# EAGLE design scoutmakes_robot_kit (EAGLE 9.6.1)
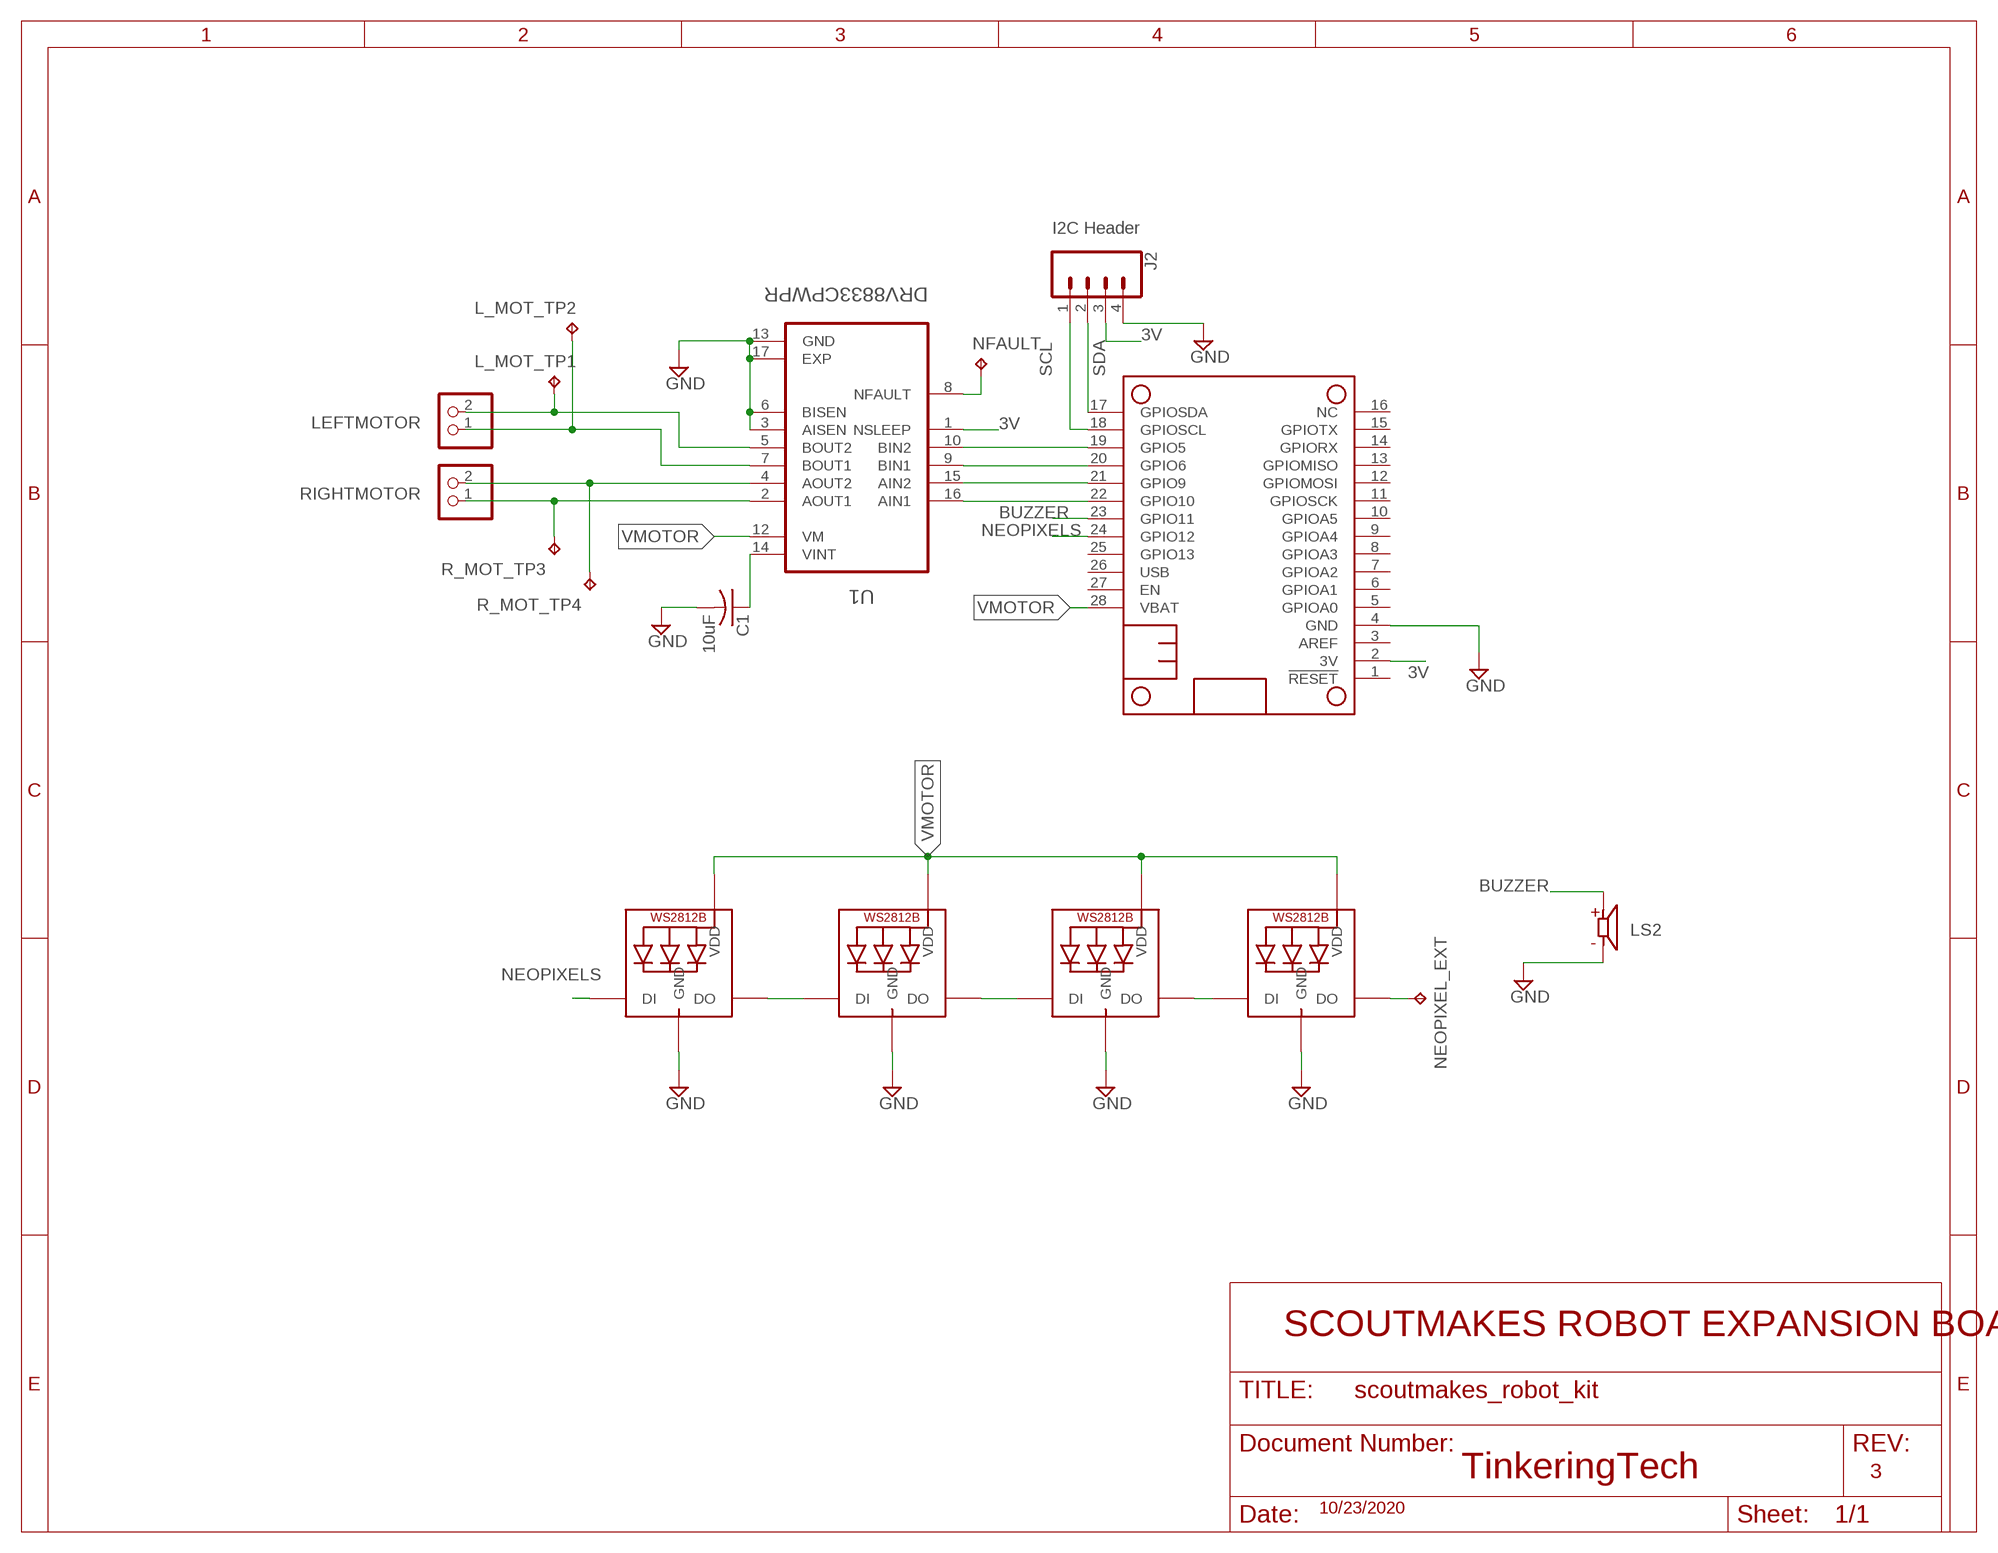
[diagram p0: schematic, sheet 1]

## Parts
C1  10uF  C-USC0805  [C0805]
J2  CONN_04  [1X04]
L_MOT_TP1  TPTP09R  [TP09R]
L_MOT_TP2  TPTP09R  [TP09R]
LED1  WS2812B_4020  [WS2812B_4020]
LED2  WS2812B_4020  [WS2812B_4020]
LED3  WS2812B_4020  [WS2812B_4020]
LED4  WS2812B_4020  [WS2812B_4020]
LEFTMOTOR  JSTPH  CON_JST_PH_2PIN  [JSTPH2]
LS2  PKMCS0909E4000-R1  [SPKR_PKMCS0909E4000-R1]
MS2  FEATHERWING_NODIM  [FEATHERWING_DIM]
NEOPIXEL_EXT  TPTP09R  [TP09R]
NFAULT  TPTP09R  [TP09R]
R_MOT_TP3  TPTP09R  [TP09R]
R_MOT_TP4  TPTP09R  [TP09R]
RIGHTMOTOR  JSTPH  CON_JST_PH_2PIN  [JSTPH2]
U1  DRV8833CPWPR  [SOP65P640X120-17N]

## Nets
3V: J2.3 MS2.2(3V) U1.1(NSLEEP)
BUZZER: LS2.1(P) MS2.23(GPIO11)
GND: C1.2 J2.4 LED1.4(GND) LED2.4(GND) LED3.4(GND) LED4.4(GND) LS2.2(N) MS2.4(GND) U1.3(AISEN) U1.6(BISEN) U1.13(GND) U1.17(EXP)
N$1: R_MOT_TP4.TP RIGHTMOTOR.2 U1.4(AOUT2)
N$2: R_MOT_TP3.TP RIGHTMOTOR.1 U1.2(AOUT1)
N$3: L_MOT_TP2.TP LEFTMOTOR.1 U1.7(BOUT1)
N$4: L_MOT_TP1.TP LEFTMOTOR.2 U1.5(BOUT2)
N$5: MS2.19(GPIO5) U1.10(BIN2)
N$6: MS2.20(GPIO6) U1.9(BIN1)
N$7: MS2.21(GPIO9) U1.15(AIN2)
N$8: MS2.22(GPIO10) U1.16(AIN1)
N$9: NFAULT.TP U1.8(NFAULT)
N$10: C1.1 U1.14(VINT)
N$11: LED1.3(DO) LED2.1(DI)
N$12: LED2.3(DO) LED3.1(DI)
N$13: LED3.3(DO) LED4.1(DI)
N$14: LED4.3(DO) NEOPIXEL_EXT.TP
NEOPIXELS: LED1.1(DI) MS2.24(GPIO12)
SCL: J2.1 MS2.18(GPIOSCL)
SDA: J2.2 MS2.17(GPIOSDA)
VMOTOR: LED1.2(VDD) LED2.2(VDD) LED3.2(VDD) LED4.2(VDD) MS2.28(VBAT) U1.12(VM)
Unconnected: MS2.1(!RESET) MS2.3(AREF) MS2.5(GPIOA0) MS2.6(GPIOA1) MS2.7(GPIOA2) MS2.8(GPIOA3) MS2.9(GPIOA4) MS2.10(GPIOA5) MS2.11(GPIOSCK) MS2.12(GPIOMOSI) MS2.13(GPIOMISO) MS2.14(GPIORX) MS2.15(GPIOTX) MS2.16(NC) MS2.25(GPIO13) MS2.26(USB) MS2.27(EN)

## Notes on the sheet
- I2C Header
- SCOUTMAKES ROBOT EXPANSION BOARD
- TinkeringTech | 3
- 10/23/2020

## Library data of the parts
C1 = adafruit:C-US: CAPACITOR, American symbol
J2 = SparkFun-Connectors:CONN_04: Multi connection point. Often used as Generic Header-pin footprint for 0.1 inch spaced/style header connections On any of the 0.1 inch spaced packages, you can populate with these: Break Away Headers - Straight <https://www.sparkfun.com/products/116> (PRT-00116) Break Away Male Headers - Right Angle <https://www.sparkfun.com/products/553> (PRT-00553) Female Headers <https://www.sparkfun.com/products/115> (PRT-00115) Break Away Headers - Machine Pin <https://www.sparkfun.com/products/117> (PRT-00117) Break Away Female Headers - Swiss Machine Pin <https://www.sparkfun.com/products/743> (PRT-00743) For SCREWTERMINALS and SPRING TERMINALS visit here: Screw Terimnals on SparkFun.com <https://www.sparkfun.com/search/results?term=Screw+Terminals> (5mm/3.5mm/2.54mm spacing) This device is also useful as a general connection point to wire up your design to another part of your project. Our various solder wires solder well into these plated through hole pads. Hook-Up Wire - Assortment (Stranded, 22 AWG) <https://www.sparkfun.com/products/11375> (PRT-11375) Hook-Up Wire - Assortment (Solid Core, 22 AWG) <https://www.sparkfun.com/products/11367> (PRT-11367) View the entire wire category on our website here <https://www.sparkfun.com/categories/141> Special notes: Molex polarized connector foot print use with SKU : PRT-08231 with associated crimp pins and housings. 1MM SMD Version SKU: PRT-10208; PROD_ID: CONN-09696
L_MOT_TP1 L_MOT_TP2 NEOPIXEL_EXT NFAULT R_MOT_TP3 R_MOT_TP4 = testpad:TP: Test pad
LED1-LED4 = microbuilder:WS2812B
LEFTMOTOR RIGHTMOTOR = microbuilder:CON_JST_PH_2PIN: JST 2-Pin Right-Angle Connector PH-Series - 4UConnector: 17311 SH-Series - 4UConnector: 07278
LS2 = PKMCS0909E4000-R1:PKMCS0909E4000-R1: Buzzers Transducer, Externally Driven Piezo 1.5V 4kHz 65dB @ 1.5V, 10cm Surface Mount Solder Pads Check prices <https://pricing.snapeda.com/parts/PKMCS0909E4000-R1/Murata/view-part?ref=eda>; AVAILABILITY: Good; DESCRIPTION: Buzzers Transducer, Externally Driven Piezo 1.5V 4kHz 65dB @ 1.5V, 10cm Surface Mount Solder Pads; MF: Murata; MP: PKMCS0909E4000-R1; PACKAGE: SMD-2 Murata; PRICE: None; PURCHASE-URL: https://pricing.snapeda.com/search/part/PKMCS0909E4000-R1/?ref=eda
MS2 = adafruit:FEATHERWING
U1 = DRV8833CPWPR:DRV8833CPWPR: 1A Low Voltage Stepper or Single/Dual Brushed DC Motor Driver (PWM Ctrl) 16-HTSSOP -40 to 85; AVAILABILITY: Unavailable; DESCRIPTION: Motor Driver Power MOSFET PWM 16-HTSSOP; MF: Texas Instruments; MP: DRV8833CPWPR; PACKAGE: HTSSOP-16 Texas Instruments; PRICE: None

## Board
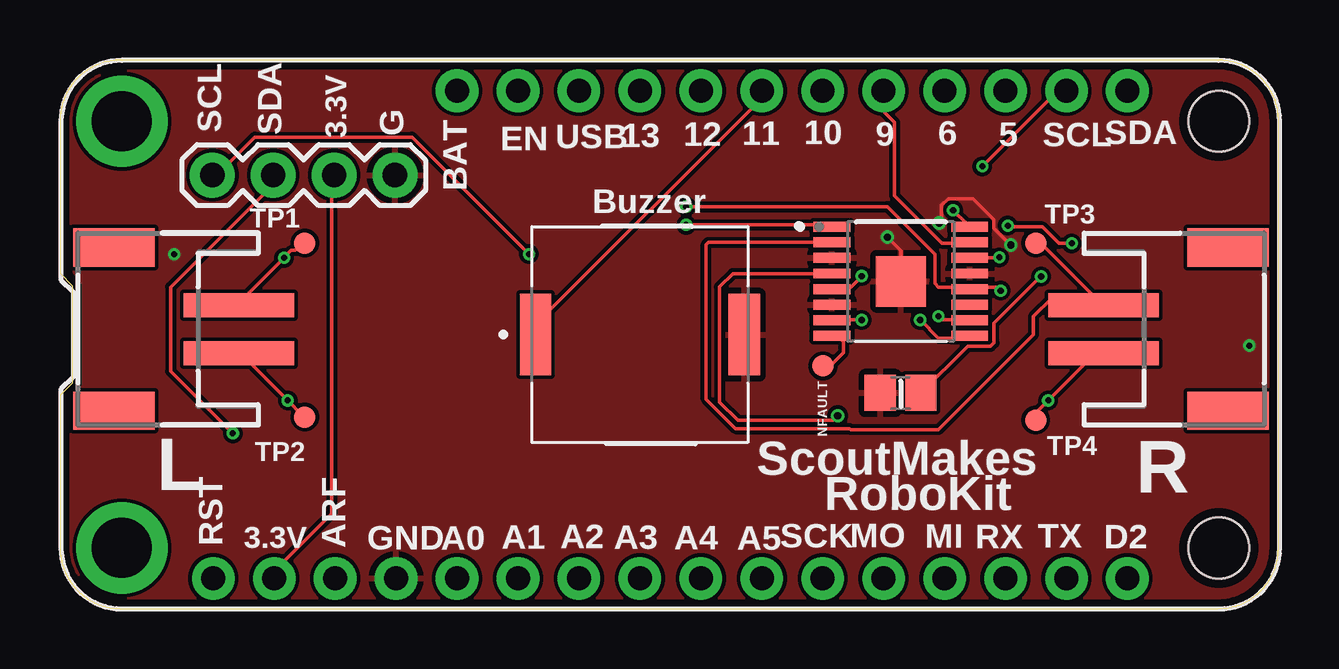
[diagram p1: board, top side]
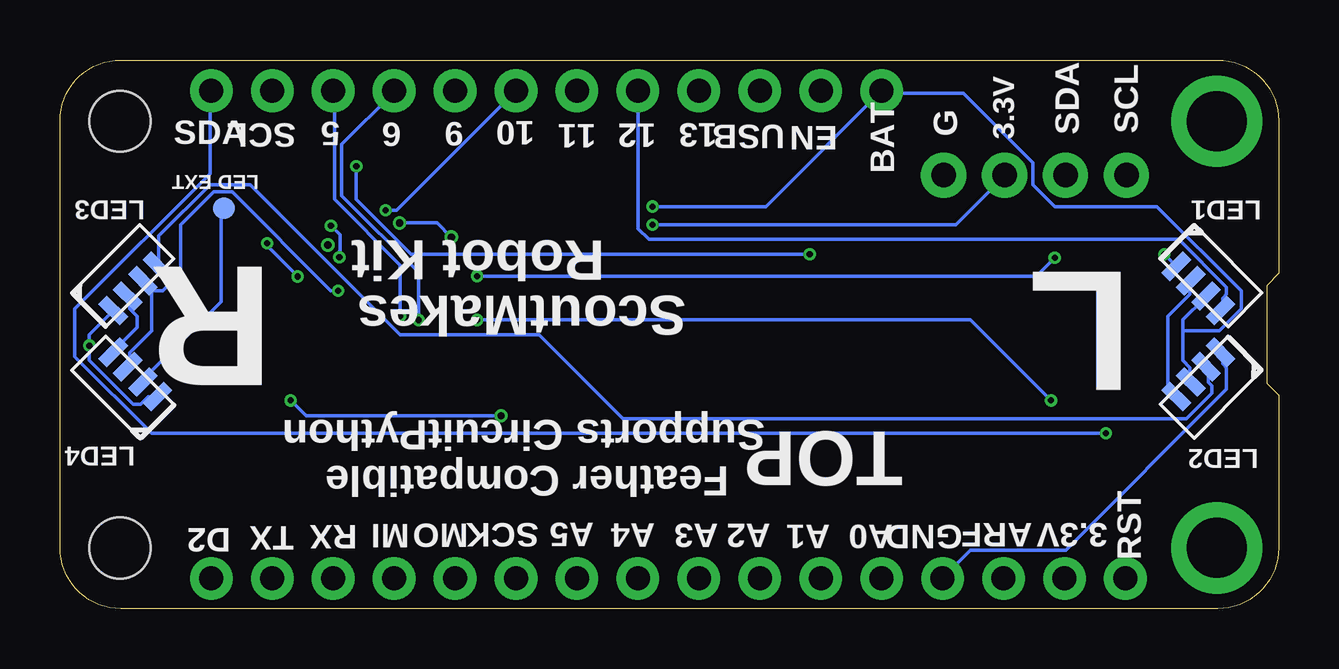
[diagram p2: board, bottom side, seen from below]

Size 50.8 x 22.86 mm. Coordinates in mm from the lower left corner, seen from the top.
Outline: 2.54,0 48.26,0 arc90 50.8,2.54 50.8,20.32 arc90 48.26,22.86 2.54,22.86 arc90 0,20.32 0,13.97 0.51,13.46 0.51,9.4 0,8.89 0,2.54 arc90 2.54,0
Copper layers (1*16): Top 0.035559375mm / dielectric 1.6mm / Bottom 0.035559375mm
Design rules "oshpark-2layer *": minimum track width 6mil, minimum drill 10mil, track to track 6mil, track to pad 6mil, pad to pad 6mil, via to via 6mil, smd to smd 6mil, copper to edge 15mil, drill to drill 6mil, minimum pad ring 5mil, minimum via ring 5mil, stop-mask expansion 2.5mil, vias tented up to drill 20mil, thermal gap 10mil

### Footprints (pad centres in the part's own frame; a part is rotated, then mirrored left to right if it is on the bottom)
C0805 = smd 1.3 x 1.5: 1 -0.85,0; 2 0.85,0
1X04 = drill 1.016 pad 1.88: 1 0,0; 2 2.54,0; 3 5.08,0; 4 7.62,0
TP09R = smd 0.9 x 0.9: TP 0,0
WS2812B_4020 = smd 0.5 x 1.25: 1 1.3,-0.75; 2 0.45,-0.75; 3 -0.45,-0.75; 4 -1.3,-0.75
JSTPH2 = smd 1 x 4.6: 1 -1,-3.7; 2 1,-3.7 | smd 1.6 x 3.4: NC1 -3.4,1.5; NC2 3.4,1.5
SPKR_PKMCS0909E4000-R1 = smd 1.3 x 3.4: 1 -4.35,0; 2 4.35,0
FEATHERWING_DIM = drill 1 pad 1.778: 1 6.35,1.27; 2 8.89,1.27; 3 11.43,1.27; 4 13.97,1.27; 5 16.51,1.27; 6 19.05,1.27; 7 21.59,1.27; 8 24.13,1.27; 9 26.67,1.27; 10 29.21,1.27; 11 31.75,1.27; 12 34.29,1.27; 13 36.83,1.27; 14 39.37,1.27; 15 41.91,1.27; 16 44.45,1.27; 17 44.45,21.59; 18 41.91,21.59; 19 39.37,21.59; 20 36.83,21.59; 21 34.29,21.59; 22 31.75,21.59; 23 29.21,21.59; 24 26.67,21.59; 25 24.13,21.59; 26 21.59,21.59; 27 19.05,21.59; 28 16.51,21.59 | drill 2.5 pad 3.81: P$1 2.54,20.32; P$2 2.54,2.54 | hole 2.54: 48.26,20.32; 48.26,2.54
SOP65P640X120-17N = smd 1.57 x 0.41: 1 -2.87,2.275; 2 -2.87,1.625; 3 -2.87,0.975; 4 -2.87,0.325; 5 -2.87,-0.325; 6 -2.87,-0.975; 7 -2.87,-1.625; 8 -2.87,-2.275; 9 2.87,-2.275; 10 2.87,-1.625; 11 2.87,-0.975; 12 2.87,-0.325; 13 2.87,0.325; 14 2.87,0.975; 15 2.87,1.625; 16 2.87,2.275 | smd 2.07 x 2.105: 17 0,0

### Placement (x,y rotation side)
C1  35.04,8.99 180 top
J2  6.35,18.06 0 top
L_MOT_TP1  10.2,15.23 0 top
L_MOT_TP2  10.2,7.98 0 top
LED1  2.82,13.87 315 bottom
LED2  2.82,9.23 225 bottom
LED3  48.19,13.87 45 bottom
LED4  48.19,9.23 135 bottom
LEFTMOTOR  3.75,11.65 90 top
LS2  24.17,11.42 0 top
MS2  0.04,-0.01 0 top
NEOPIXEL_EXT  43.97,16.68 0 bottom
NFAULT  31.8,10.11 0 top
R_MOT_TP3  40.67,15.23 0 top
R_MOT_TP4  40.67,7.86 0 top
RIGHTMOTOR  47.19,11.65 270 top
U1  35.05,13.64 0 top

### Tracks (layer width: path | path; a pad name or v marks a point on that pad's centre or on a via)
3V  (via drill 0.25)
  Top 0.152: v26.1,15.99 32.05,15.99 U1.1 | MS2.2 9.03,1.36 9.03,1.66 11.32,3.95 11.32,17.97 J2.3
  Bottom 0.152: v26.1,15.99 13.45,15.99 11.47,17.97 J2.3
BUZZER
  Top 0.152: LS2.1 19.85,11.42 19.85,11.88 29.15,21.17 29.15,21.48 MS2.23
GND  (via drill 0.25, 0.3)
  Top 0.152: U1.17 35.05,14.92 v34.49,15.48 | v39.63,15.15 38.93,15.85 38.93,16.2 38.05,17.08 37.03,17.08 36.74,16.8 36.74,16.17 v36.64,16.07
  Bottom 0.152: LED4.4 46.83,8.83 47.13,8.83 47.44,8.52 47.74,8.52 49.57,10.35 v49.57,10.96 49.57,11.42 48.66,12.33 LED3.4 | MS2.4 12.84,2.43 8.88,2.43 2.18,9.13 2.18,10.05 2.33,10.2 2.33,10.66 LED2.4 | v4.77,14.77 4.31,14.31 LED1.4 | v34.49,15.48 35.08,16.07 v36.64,16.07 | v39.63,15.15 39.65,15.13
  pour Top: 2.58,-0.01 arc-90 0.04,2.53 0.04,20.31 arc-90 2.58,22.85 48.3,22.85 arc-90 50.84,20.31 50.84,2.53 arc-90 48.3,-0.01
N$1  (via drill 0.25, 0.3)
  Top 0.152: R_MOT_TP4.TP 40.73,7.91 40.73,8.22 v41.19,8.68 43.02,10.5 43.48,10.5 RIGHTMOTOR.2 | U1.4 28.05,13.96 27.49,13.4 27.49,8.61 28.25,7.84 32.22,7.84 v32.41,8.03
  Bottom 0.152: v32.41,8.03 40.55,8.03 v41.19,8.68
N$2
  Top 0.152: R_MOT_TP3.TP 40.88,15.23 43.17,12.94 | 43.17,12.94 43.48,12.64 RIGHTMOTOR.1 43.17,12.94 | 43.17,12.94 41.34,12.94 40.58,12.18 40.58,11.42 36.62,7.46 32.96,7.46 32.91,7.5 28.16,7.5 26.93,8.73 26.93,15.17 27.03,15.26 U1.2
N$3  (via drill 0.25)
  Top 0.152: L_MOT_TP2.TP 10.1,8.07 v9.49,8.68 7.51,10.66 LEFTMOTOR.1 | v33.42,12.03 32.2,12.03 U1.7
  Bottom 0.152: v33.42,12.03 12.84,12.03 v9.49,8.68
N$4  (via drill 0.25)
  Top 0.152: L_MOT_TP1.TP 10.1,15.23 9.8,14.92 9.64,14.92 v9.34,14.62 7.51,12.79 LEFTMOTOR.2 | v33.42,13.86 32.96,13.4 32.2,13.4 U1.5
  Bottom 0.152: v33.42,13.86 10.1,13.86 v9.34,14.62
N$5  (via drill 0.25)
  Top 0.152: v36.62,12.18 36.77,12.03 37.84,12.03 U1.10
  Bottom 0.152: v36.62,12.18 36.62,14.31 39.36,17.06 39.36,21.48 MS2.19
N$6  (via drill 0.25)
  Top 0.152: v35.86,12.03 36.62,11.27 37.84,11.27 U1.9
  Bottom 0.152: v35.86,12.03 35.86,14.01 39.06,17.21 39.06,19.34 36.92,21.48 MS2.20
N$7
  Top 0.152: MS2.21 34.33,20.71 34.79,20.26 34.79,17.21 36.77,15.23 37.84,15.23 U1.15
N$8  (via drill 0.25)
  Top 0.152: v37.23,16.6 37.84,15.99 U1.16
  Bottom 0.152: v37.23,16.6 36.77,16.6 MS2.22
N$9
  Top 0.152: NFAULT.TP 31.89,10.2 32.2,10.2 32.66,10.66 32.66,11.11 32.5,11.27 32.2,11.27 U1.8
N$10  (via drill 0.25)
  Top 0.152: U1.14 37.99,14.62 39.14,14.62 v39.15,14.64 | C1.1 37.83,10.93 38.79,10.93 38.93,11.08 38.93,11.88 v40.89,13.84 | v42.17,15.22 41.64,15.22 40.95,15.91 39.56,15.91 v39.51,15.96
  Bottom 0.152: v40.89,13.84 42.17,15.12 v42.17,15.22 | v39.15,14.64 39.15,14.92 39.13,14.94 39.13,15.58 v39.51,15.96
N$11
  Bottom 0.152: LED1.3 3.7,13.55 3.7,13.09 4.61,12.18 4.61,9.28 4.31,8.98 LED2.1
N$12
  Bottom 0.152: LED2.3 2.94,10.05 2.94,9.44 2.78,9.28 2.78,8.98 3.85,7.91 27.32,7.91 30.83,11.42 36.62,11.42 42.87,17.67 44.54,17.67 46.68,15.53 46.68,14.31 LED3.1
N$13
  Bottom 0.152: LED3.3 47.9,12.94 47.9,12.49 47.59,12.18 47.59,11.72 48.5,10.81 LED4.1
N$14
  Bottom 0.152: NEOPIXEL_EXT.TP 44.09,16.6 44.09,12.79 47.29,9.59 LED4.3
NEOPIXELS
  Bottom 0.152: MS2.24 26.71,15.84 26.25,15.38 4.16,15.38 2.18,13.4 2.18,13.09 2.33,12.94 2.33,12.49 LED1.1
SCL  (via drill 0.25)
  Top 0.152: v38.45,18.43 41.49,21.48 41.95,21.48 MS2.18 | v19.55,14.77 14.67,19.65 8.12,19.65 6.44,17.97 J2.1
  Bottom 0.152: v38.45,18.43 38.45,17.06 36.16,14.77 v19.55,14.77
SDA  (via drill 0.25)
  Top 0.152: v7.2,7.3 4.61,9.89 4.61,13.4 8.88,17.67 8.88,17.97 J2.2
  Bottom 0.152: v7.2,7.3 46.98,7.3 50.18,10.5 50.18,12.49 44.54,18.12 44.54,21.48 MS2.17
VMOTOR  (via drill 0.25)
  Top 0.152: v39.21,13.25 39.06,13.4 37.99,13.4 U1.12 37.84,13.4 36.62,13.4 36.47,13.55 36.47,14.77 34.48,16.75 v26.1,16.75
  Bottom 0.152: 46.98,13.25 46.98,11.57 47.9,10.66 47.9,10.2 LED4.2 | 46.98,13.25 47.29,13.55 LED3.2 46.98,13.25 | v39.21,13.25 39.51,13.25 43.63,17.36 44.39,17.36 45.76,15.99 45.76,14.01 46.52,13.25 46.98,13.25 | 4,11.57 4,12.03 3.09,12.94 LED1.2 | 4,11.57 4,10.35 3.7,10.05 3.7,9.59 LED2.2 | 4,11.57 2.48,11.57 1.57,12.49 1.57,13.25 5.07,16.75 9.34,16.75 10.25,17.67 10.25,18.58 13.15,21.48 16.5,21.48 MS2.28 21.38,16.75 v26.1,16.75

### Text on the board
_tplace: 3.3V | SCL | SDA | G | BAT | EN | USB | 13 | 12 | 11 | 10 | 9 | 6 | 5 | SCL | SDA | TP1 | Buzzer | TP3 | ScoutMakes | TP2 | TP4 | L | R | RoboKit | SCK | MO | MI | RX | TX | D2 | RST | 3.3V | ARF | A2 | A3 | A4 | A5 | GND | A0 | A1
_bplace: 3.3V | SCL | SDA | G | EN | USB | 13 | 12 | 11 | 10 | 9 | 6 | 5 | SCL | SDA | BAT | LED EXT | LED1 | LED3 | Robot Kit | L | R | ScoutMakes | Feather Compatible / Supports CircuitPython | LED2 | TOP | LED4 | RST | 3.3V | ARF | GND | A0 | A1 | A2 | A3 | A4 | A5 | SCK | MO | MI | RX | TX | D2